# Altium project pdb.PrjPcb
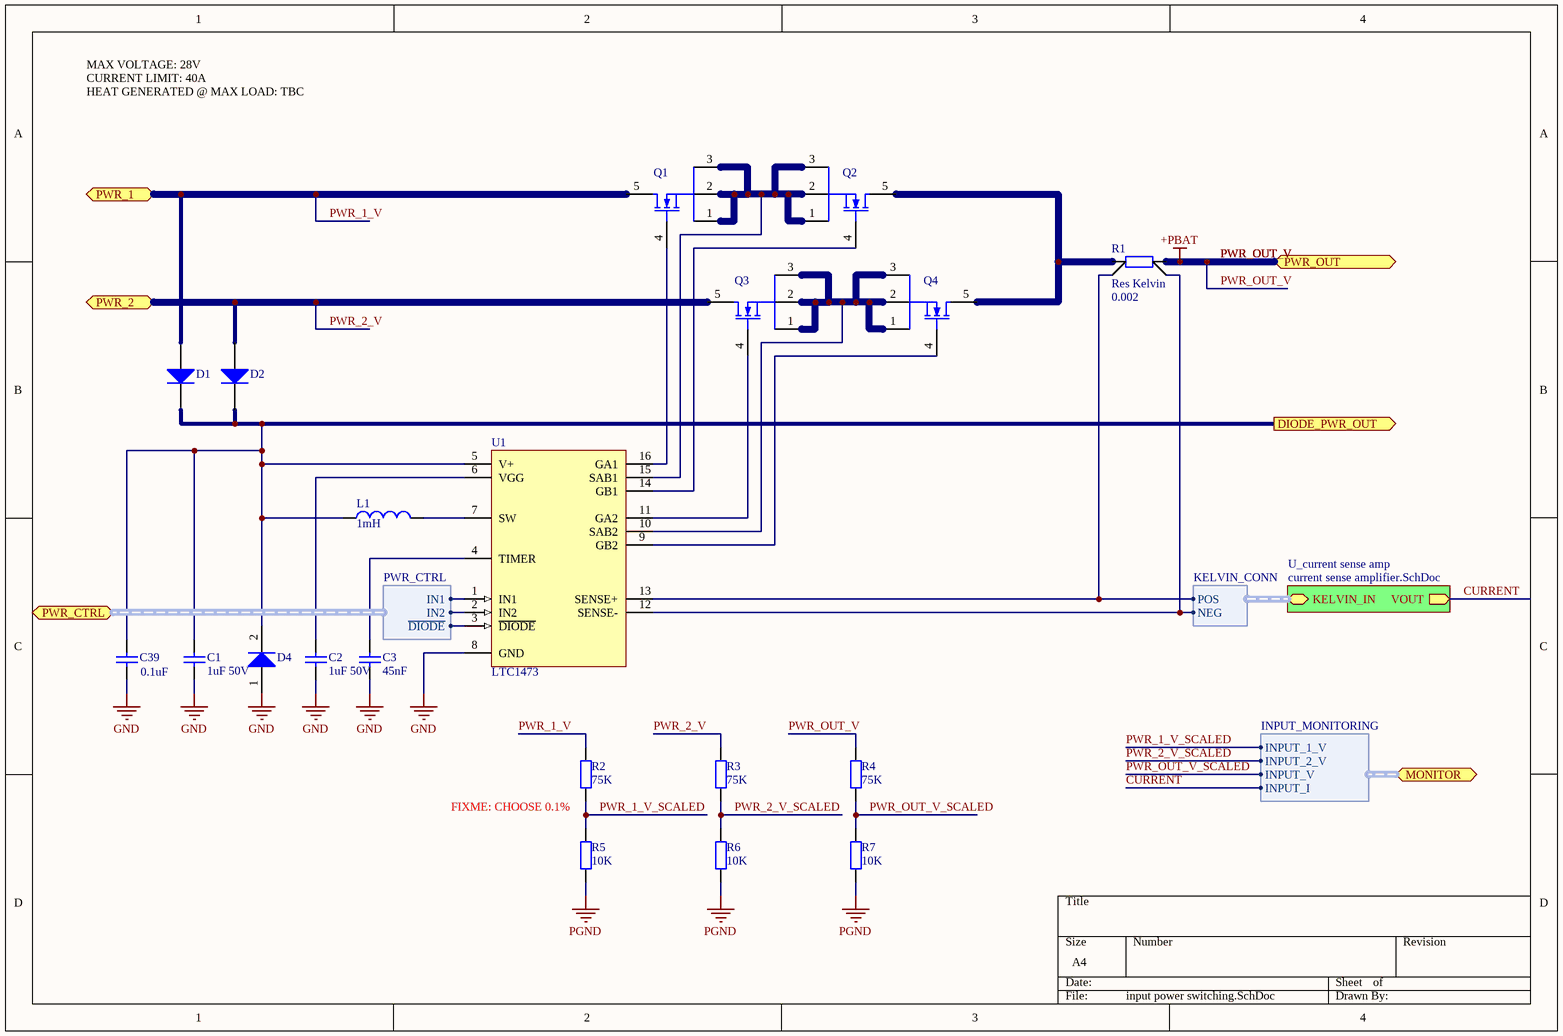
[diagram p0: input power switching.SchDoc]
8 sheets, 51 parts. Net scope: hierarchical (ports join the sheet entries above them; power ports are global).
Board files: pdb.PcbDoc, pdb v2.PcbDoc
Sheets:
  input power switching.SchDoc
  outputs.SchDoc
    U_can connector = can connector.SchDoc
    U_low voltage output controller = low voltage output controller.SchDoc
    U_low voltage output controller = low voltage output controller.SchDoc
  logic.SchDoc
    U_mcu = mcu.SchDoc
    U_spi can controller = spi can controller.SchDoc
    U_Xilinx JTAG Header = Xilinx JTAG Header.SchDoc

## Sheet input power switching.SchDoc
size A4

### Parts
C1  value 1uF 50V  [C0603]  (hidden comment: Cap)
C2  value 1uF 50V  [C0603]  (hidden comment: Cap)
C3  value 45nF  [C0603]  (hidden comment: Cap)
C39  value 0.1uF  [C0603]  (hidden comment: Cap)
D1  Diode  [VS-10BQ030TRPBF]  (value not drawn)
D2  Diode  [VS-10BQ030TRPBF]  (value not drawn)
D4  Diode  [MMBD914LT1G]  (value not drawn)
L1  value 1mH  [744045102]  (hidden comment: Inductor)
Q1  PSMN1R7-30YL  [PSMN1R7-30YL]  (value not drawn)
Q2  PSMN1R7-30YL  [PSMN1R7-30YL]  (value not drawn)
Q3  PSMN1R7-30YL  [PSMN1R7-30YL]  (value not drawn)
Q4  PSMN1R7-30YL  [PSMN1R7-30YL]  (value not drawn)
R1  Res Kelvin  value 0.002  [WSR32L000FEA]  (net tie, no BOM)
R2  value 75K  [R0603]  (hidden comment: Res2)
R3  value 75K  [R0603]  (hidden comment: Res2)
R4  value 75K  [R0603]  (hidden comment: Res2)
R5  value 10K  [R0603]  (hidden comment: Res)
R6  value 10K  [R0603]  (hidden comment: Res)
R7  value 10K  [R0603]  (hidden comment: Res)
U1  LTC1473  [LTC1473]

### Sub-sheets
U_current sense amp = current sense amplifier.SchDoc (file not in this document): KELVIN_IN (harness KELVIN_CONN), VOUT (out)

### Ports
DIODE_PWR_OUT (out), MONITOR (harness INPUT_MONITORING), PWR_1, PWR_2, PWR_CTRL (harness PWR_CTRL), PWR_OUT

### Harnesses
KELVIN_CONN: POS, NEG
PWR_CTRL: IN1, IN2, ~{DIODE}
INPUT_MONITORING: INPUT_I, INPUT_1_V, INPUT_2_V, INPUT_V

### Nets
+PBAT: R4.1 ; port PWR_OUT  [also labelled PWR_OUT_V]
GND: C1.1 C2.1 C3.1 C39.1 D4.1(A) U1.8(GND)
PGND: R5.2 R6.2 R7.2
CURRENT: sheet U_current sense amp/VOUT, port MONITOR.INPUT_I
PWR_1_V: D1.1(A) Q1.5(D) R2.2 ; port PWR_1
PWR_1_V_SCALED: R2.1 R5.1 ; port MONITOR.INPUT_1_V
PWR_2_V: D2.1(A) Q3.5(D) R3.2 ; port PWR_2
PWR_2_V_SCALED: R3.1 R6.1 ; port MONITOR.INPUT_2_V
PWR_OUT_V_SCALED: R4.1 R7.1 ; port MONITOR.INPUT_V
NetC1_2: C1.2 C39.2 D1.2(K) D2.2(K) D4.2(K) L1.1 U1.5(V+) ; port DIODE_PWR_OUT
NetC2_2: C2.2 U1.6(VGG)
NetC3_2: C3.2 U1.4(TIMER)
NetL1_2: L1.2 U1.7(SW)
NetQ1_1: Q1.1(S) Q1.2(S) Q1.3(S) Q2.1(S) Q2.2(S) Q2.3(S) U1.15(SAB1)
NetQ1_4: Q1.4(G) U1.16(GA1)
NetQ2_4: Q2.4(G) U1.14(GB1)
NetQ2_5: Q2.5(D) Q4.5(D) R1.2
NetQ3_1: Q3.1(S) Q3.2(S) Q3.3(S) Q4.1(S) Q4.2(S) Q4.3(S) U1.10(SAB2)
NetQ3_4: Q3.4(G) U1.11(GA2)
NetQ4_4: Q4.4(G) U1.9(GB2)
NetR1_3: R1.3 U1.12(SENSE-) ; sheet U_current sense amp/KELVIN_IN.NEG
NetR1_4: R1.4 U1.13(SENSE+) ; sheet U_current sense amp/KELVIN_IN.POS
NetU1_1: U1.1(IN1) ; port PWR_CTRL.IN1
NetU1_2: U1.2(IN2) ; port PWR_CTRL.IN2
NetU1_3: U1.3(~{DIODE}) ; port PWR_CTRL.~{DIODE}

Not connected (* = marked no-connect by the designer): R1 1

### Notes on the sheet
- MAX VOLTAGE: 28V
- CURRENT LIMIT: 40A
- HEAT GENERATED @ MAX LOAD: TBC
- FIXME: CHOOSE 0.1%

### Library data of the parts
C1-C3 C39 = Cap: Capacitor; Published: 8-Jun-2000; LatestRevisionDate: 17-Jul-2002; LatestRevisionNote: Re-released for DXP Platform.; PackageReference: RAD-0.3; Publisher: Altium Limited
  C1 C2: farnell: 1845736
  C3: farnell: 1759031
  C39: farnell: 9406140
D1 D2 D4 = Diode: Default Diode; Published: 8-Jun-2000; LatestRevisionDate: 17-Jul-2002; LatestRevisionNote: Re-released for DXP Platform.; PackageVersion: Sep-1996; PackageReference: SMC; Publisher: Altium Limited; Code_JEDEC: DO-214-AB
  D1 D2: farnell: 9100687
  D4: farnell: 1431125
L1 = Inductor: Code_IEC: 1005; Published: 8-Jun-2000; LatestRevisionDate: 29-May-2009; LatestRevisionNote: IPC-7351 Footprint Added.; PackageReference: 0402-A; Publisher: Altium Limited; PackageDescription: Chip Inductor; Code_JEITA: 0402; farnell: 1800422
Q1-Q4 = PSMN1R7-30YL: NXP - PSMN1R7-30YL - MOSFET, N CH 30V 100A SOT669; farnell: 1699701
R1 = Res Kelvin: Resistor Kelvin; Published: 8-Jun-2000; LatestRevisionDate: 17-Jul-2002; LatestRevisionNote: Re-released for DXP Platform.; PackageReference: AXIAL-0.4; Publisher: Altium Limited; farnell: 1107461
R2-R7 = Res2: Resistor
  R2-R4: Published: 8-Jun-2000; LatestRevisionDate: 17-Jul-2002; LatestRevisionNote: Re-released for DXP Platform.; PackageReference: AXIAL-0.4; Publisher: Altium Limited; farnell: 9331522
  R5-R7: farnell: 1576297
U1 = LTC1473: IC SWITCH DVR PWRPATH DUAL16SSOP; digikey: LTC1473CGN#PBF-ND; farnell: 1273517

## Sheet outputs.SchDoc
size A4
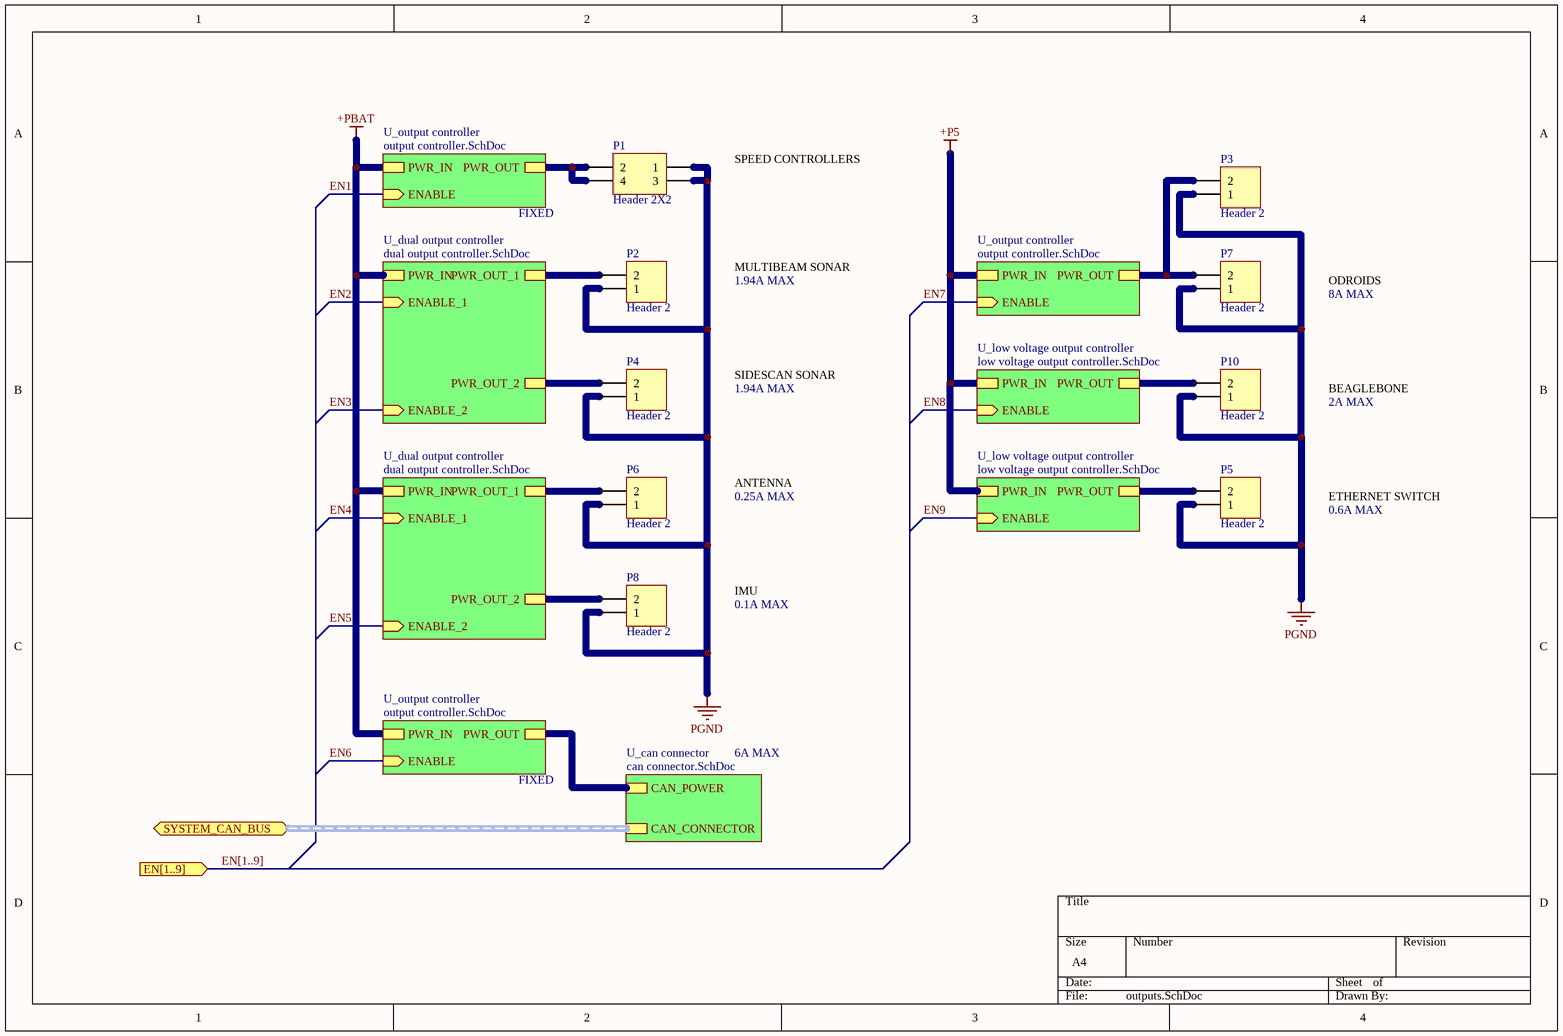
[diagram p1: outputs.SchDoc]

### Parts
(Parts that share a designator on the sheet are numbered #1, #2 ... from top to bottom, then left to right.)
P1#1  Header 2X2  [39-28-1043]
P2  Header 2  [39-28-1023]
P3  Header 2  [43045-0212]
P4  Header 2  [39-28-1023]
P5  Header 2  [43045-0212]
P6  Header 2  [39-28-1023]
P7  Header 2  [43045-0212]
P8  Header 2  [39-28-1023]
P10  Header 2  [43045-0212]

### Sub-sheets
U_can connector = can connector.SchDoc: CAN_CONNECTOR (harness CAN), CAN_POWER
U_dual output controller = dual output controller.SchDoc (file not in this document): ENABLE_1 (in), ENABLE_2 (in), PWR_OUT_1, PWR_OUT_2, PWR_IN
U_dual output controller = dual output controller.SchDoc (file not in this document): ENABLE_1 (in), ENABLE_2 (in), PWR_OUT_1, PWR_OUT_2, PWR_IN
U_low voltage output controller = low voltage output controller.SchDoc: PWR_IN, PWR_OUT, ENABLE (in)
U_low voltage output controller = low voltage output controller.SchDoc: PWR_IN, PWR_OUT, ENABLE (in)
U_output controller = output controller.SchDoc (file not in this document): PWR_IN, PWR_OUT, ENABLE (in)
U_output controller = output controller.SchDoc (file not in this document): PWR_IN, PWR_OUT, ENABLE (in)
U_output controller = output controller.SchDoc (file not in this document): PWR_IN, PWR_OUT, ENABLE (in)

### Ports
EN[1..9] (in), SYSTEM_CAN_BUS (harness CAN)

### Nets
+P5: sheet U_output controller/PWR_IN, sheet U_low voltage output controller/PWR_IN, sheet U_low voltage output controller/PWR_IN
+PBAT: sheet U_output controller/PWR_IN, sheet U_output controller/PWR_IN, sheet U_dual output controller/PWR_IN, sheet U_dual output controller/PWR_IN
PGND: P1#1.1 P1#1.3 P2.1 P3.1 P4.1 P5.1 P6.1 P7.1 P8.1 P10.1
EN1: sheet U_output controller/ENABLE
EN2: sheet U_dual output controller/ENABLE_1
EN3: sheet U_dual output controller/ENABLE_2
EN4: sheet U_dual output controller/ENABLE_1
EN5: sheet U_dual output controller/ENABLE_2
EN6: sheet U_output controller/ENABLE
EN7: sheet U_output controller/ENABLE
NetP1#1_2: P1#1.2 P1#1.4 ; sheet U_output controller/PWR_OUT
NetP2_2: P2.2 ; sheet U_dual output controller/PWR_OUT_1
NetP3_2: P3.2 P7.2 ; sheet U_output controller/PWR_OUT
NetP4_2: P4.2 ; sheet U_dual output controller/PWR_OUT_2
NetP5_2: P5.2 ; sheet U_low voltage output controller/PWR_OUT
NetP6_2: P6.2 ; sheet U_dual output controller/PWR_OUT_1
NetP8_2: P8.2 ; sheet U_dual output controller/PWR_OUT_2
NetP10_2: P10.2 ; sheet U_low voltage output controller/PWR_OUT
NetP11_2: sheet U_can connector/CAN_POWER, sheet U_output controller/PWR_OUT

### Buses and harness runs
bus EN[1..9] = port EN[1..9]
harness port SYSTEM_CAN_BUS = sheet U_can connector/CAN_CONNECTOR

### Notes on the sheet
- SPEED CONTROLLERS
- FIXED
- MULTIBEAM SONAR
- 1.94A MAX
- ODROIDS
- 8A MAX
- SIDESCAN SONAR
- BEAGLEBONE
- 2A MAX
- ANTENNA
- 0.25A MAX
- ETHERNET SWITCH
- 0.6A MAX
- IMU
- 0.1A MAX
- 6A MAX

### Library data of the parts
P1#1 = Header 2X2: Header, 2-Pin, Dual row; LatestRevisionDate: 17-Jul-2002; LatestRevisionNote: Re-released for DXP Platform.; Publisher: Altium Limited; farnell: 9732098
P2-P8 P10 = Header 2: Header, 2-Pin; LatestRevisionDate: 17-Jul-2002; LatestRevisionNote: Re-released for DXP Platform.; Publisher: Altium Limited
  P2 P4 P6 P8: farnell: 9732080
  P3 P5 P7 P10: farnell: 9733000

## Sheet can connector.SchDoc
size A4
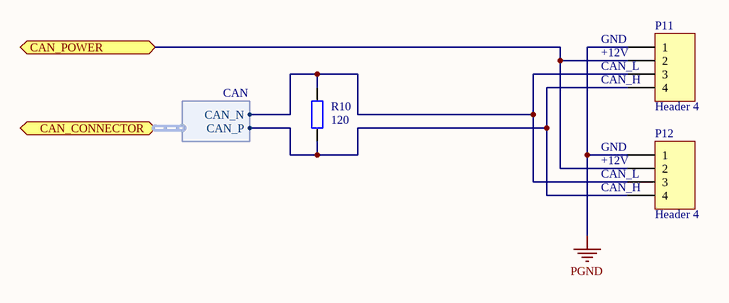
[diagram p2: can connector.SchDoc]

### Parts
P11  Header 4  [B04B-PASK-1]
P12  Header 4  [B04B-PASK-1]
R10  value 120  [R0603]  (hidden comment: Res2)

### Ports
CAN_CONNECTOR (harness CAN), CAN_POWER

### Harnesses
CAN: CAN_N, CAN_P

### Nets
PGND: P11.1 P12.1
NetP11_2: P11.2 P12.2 ; port CAN_POWER
NetP11_3: P11.3 P12.3 R10.2 ; port CAN_CONNECTOR.CAN_N
NetP11_4: P11.4 P12.4 R10.1 ; port CAN_CONNECTOR.CAN_P

### Notes on the sheet
- (near P11) GND
- (near P11) +12V
- (near P11) CAN_L
- (near P11) CAN_H
- (near P12) GND
- (near P12) +12V
- (near P12) CAN_L
- (near P12) CAN_H

### Library data of the parts
P11 P12 = Header 4: Header, 4-Pin; LatestRevisionDate: 17-Jul-2002; LatestRevisionNote: Re-released for DXP Platform.; Publisher: Altium Limited; farnell: 1830749
R10 = Res2: Resistor; Published: 8-Jun-2000; LatestRevisionDate: 17-Jul-2002; LatestRevisionNote: Re-released for DXP Platform.; PackageReference: AXIAL-0.4; Publisher: Altium Limited; farnell: 9330496

## Sheet low voltage output controller.SchDoc
size A4
Used 2 times, as channels U_low voltage output controller, U_low voltage output controller. Parts and nets are listed once, with the designators drawn on the sheet.
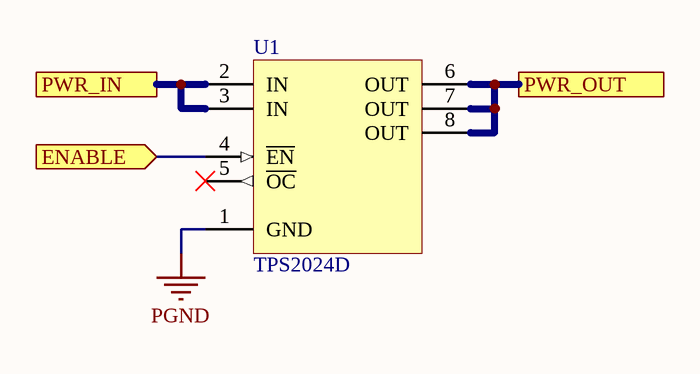
[diagram p3: low voltage output controller.SchDoc]

### Parts
U1  TPS2024D  [TPS2024D]

### Ports
ENABLE (in), PWR_IN, PWR_OUT

### Nets
PGND: U1.1(GND)
ENABLE: U1.4(~{EN}) ; port ENABLE
PWR_IN: U1.2(IN) U1.3(IN) ; port PWR_IN
PWR_OUT: U1.6(OUT) U1.7(OUT) U1.8(OUT) ; port PWR_OUT

Not connected (* = marked no-connect by the designer): U1 5(~{OC})*

### Channels
U_low voltage output controller: designators U1=U2; ports ENABLE=EN8 PWR_IN=+P5 PWR_OUT=NetP10_2
U_low voltage output controller: designators U1=U3; ports ENABLE=EN9 PWR_IN=+P5 PWR_OUT=NetP5_2

### Library data of the parts
U1 = TPS2024D: TEXAS INSTRUMENTS - TPS2024D - IC, 3A PWR DIST SWITCH 8-SOIC; farnell: 1755295

## Sheet logic.SchDoc
size A4
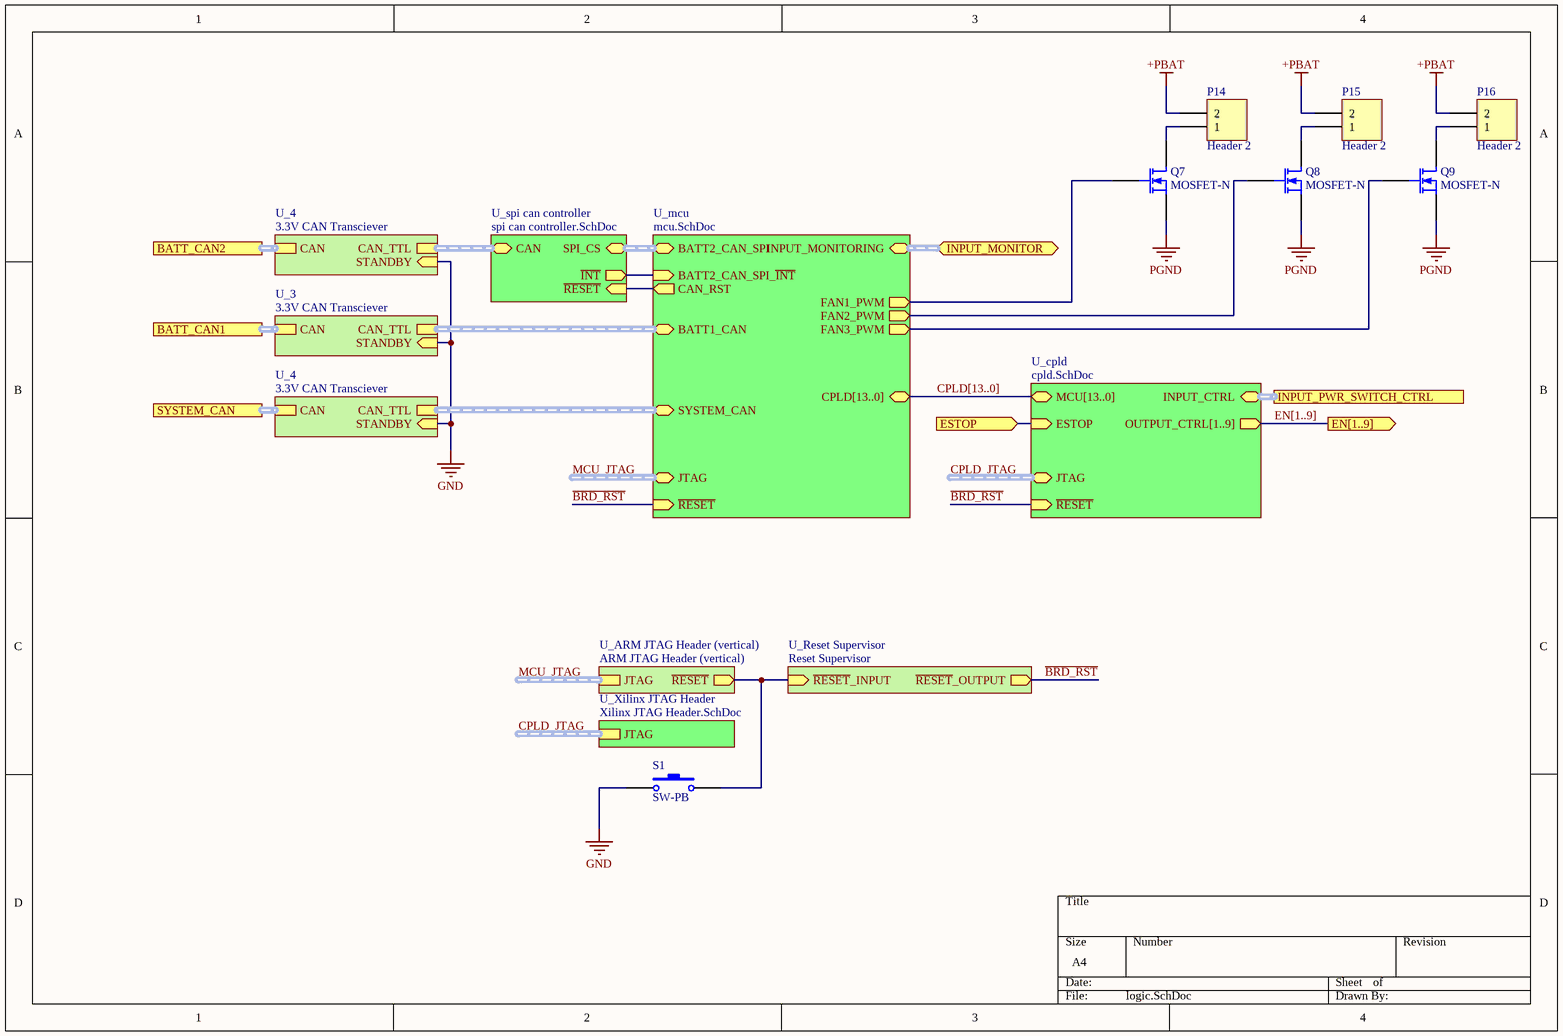
[diagram p4: logic.SchDoc]

### Parts
P14  Header 2  [HDR1X2]
P15  Header 2  [HDR1X2]
P16  Header 2  [HDR1X2]
Q7  MOSFET-N  [TSM2306CX]
Q8  MOSFET-N  [TSM2306CX]
Q9  MOSFET-N  [TSM2306CX]
S1  SW-PB  [DTSM-32S-B]

### Sub-sheets
U_3 = 3.3V CAN Transciever (file not in this document): CAN_TTL (harness CAN_TTL), CAN (harness CAN), STANDBY (in)
U_4 = 3.3V CAN Transciever (file not in this document): CAN_TTL (harness CAN_TTL), CAN (harness CAN), STANDBY (in)
U_4 = 3.3V CAN Transciever (file not in this document): CAN_TTL (harness CAN_TTL), CAN (harness CAN), STANDBY (in)
U_ARM JTAG Header (vertical) = ARM JTAG Header (vertical) (file not in this document): JTAG (harness ARM_JTAG), ~{RESET} (out)
U_cpld = cpld.SchDoc (file not in this document): OUTPUT_CTRL[1..9] (out), INPUT_CTRL (harness PWR_CTRL), ESTOP (in), MCU[13..0] (bidir), JTAG (harness ARM_JTAG), ~{RESET} (in)
U_mcu = mcu.SchDoc: SYSTEM_CAN (harness CAN_TTL), BATT2_CAN_SPI (harness SPI_CS), BATT1_CAN (harness CAN_TTL), CPLD[13..0] (bidir), JTAG (harness ARM_JTAG), ~{RESET} (in), BATT2_CAN_SPI_~{INT} (in), CAN_RST (out), FAN1_PWM (out), FAN2_PWM (out), FAN3_PWM (out), INPUT_MONITORING (harness INPUT_MONITORING)
U_Reset Supervisor = Reset Supervisor (file not in this document): ~{RESET}_OUTPUT (out), ~{RESET}_INPUT (in)
U_spi can controller = spi can controller.SchDoc: CAN (harness CAN_TTL), SPI_CS (harness SPI_CS), ~{INT} (out), ~{RESET} (in)
U_Xilinx JTAG Header = Xilinx JTAG Header.SchDoc: JTAG (harness ARM_JTAG)

### Ports
BATT_CAN1 (harness CAN), BATT_CAN2 (harness CAN), EN[1..9] (out), ESTOP (in), INPUT_MONITOR (harness INPUT_MONITORING), INPUT_PWR_SWITCH_CTRL (harness PWR_CTRL), SYSTEM_CAN (harness CAN)

### Nets
+PBAT: P14.2 P15.2 P16.2
GND: S1.1 ; sheet U_3/STANDBY, sheet U_4/STANDBY, sheet U_4/STANDBY
PGND: Q7.3(S) Q8.3(S) Q9.3(S)
~{BRD_RST}: sheet U_cpld/~{RESET}, sheet U_mcu/~{RESET}, sheet U_Reset Supervisor/~{RESET}_OUTPUT
NetP14_1: P14.1 Q7.1(D)
NetP15_1: P15.1 Q8.1(D)
NetP16_1: P16.1 Q9.1(D)
NetQ7_2: Q7.2(G) ; sheet U_mcu/FAN1_PWM
NetQ8_2: Q8.2(G) ; sheet U_mcu/FAN2_PWM
NetQ9_2: Q9.2(G) ; sheet U_mcu/FAN3_PWM
NetS1_2: S1.2 ; sheet U_Reset Supervisor/~{RESET}_INPUT, sheet U_ARM JTAG Header (vertical)/~{RESET}
NetU4_41: sheet U_mcu/BATT2_CAN_SPI_~{INT}, sheet U_spi can controller/~{INT}
NetU4_44: sheet U_mcu/CAN_RST, sheet U_spi can controller/~{RESET}
(unnamed): port ESTOP, sheet U_cpld/ESTOP

### Buses and harness runs
bus CPLD[13..0] = sheet U_cpld/MCU[13..0] = sheet U_mcu/CPLD[13..0]
bus EN[1..9] = port EN[1..9] = sheet U_cpld/OUTPUT_CTRL[1..9]
harness CPLD_JTAG = sheet U_cpld/JTAG
harness CPLD_JTAG = sheet U_Xilinx JTAG Header/JTAG
harness MCU_JTAG = sheet U_ARM JTAG Header (vertical)/JTAG
harness MCU_JTAG = sheet U_mcu/JTAG
harness port BATT_CAN1 = sheet U_3/CAN
harness port BATT_CAN2 = sheet U_4/CAN
harness port INPUT_MONITOR = sheet U_mcu/INPUT_MONITORING
harness port INPUT_PWR_SWITCH_CTRL = sheet U_cpld/INPUT_CTRL
harness port SYSTEM_CAN = sheet U_4/CAN
harness sheet U_3/CAN_TTL = sheet U_mcu/BATT1_CAN
harness sheet U_4/CAN_TTL = sheet U_mcu/SYSTEM_CAN
harness sheet U_4/CAN_TTL = sheet U_spi can controller/CAN
harness sheet U_mcu/BATT2_CAN_SPI = sheet U_spi can controller/SPI_CS

### Library data of the parts
P14-P16 = Header 2: Header, 2-Pin; LatestRevisionDate: 17-Jul-2002; LatestRevisionNote: Re-released for DXP Platform.; Publisher: Altium Limited
Q7-Q9 = MOSFET-N: N-Channel MOSFET; Published: 8-Jun-2000; LatestRevisionDate: 17-Jul-2002; LatestRevisionNote: Re-released for DXP Platform.; PackageVersion: 1995/1996; PackageReference: E3; Publisher: Altium Limited; farnell: 1864577
S1 = SW-PB: Switch; Published: 24-Mar-1999; LatestRevisionDate: 17-Jul-2002; LatestRevisionNote: Re-released for DXP Platform.; PackageReference: SPST-2; Publisher: Altium Limited; farnell: 9471898

## Sheet mcu.SchDoc
size A4
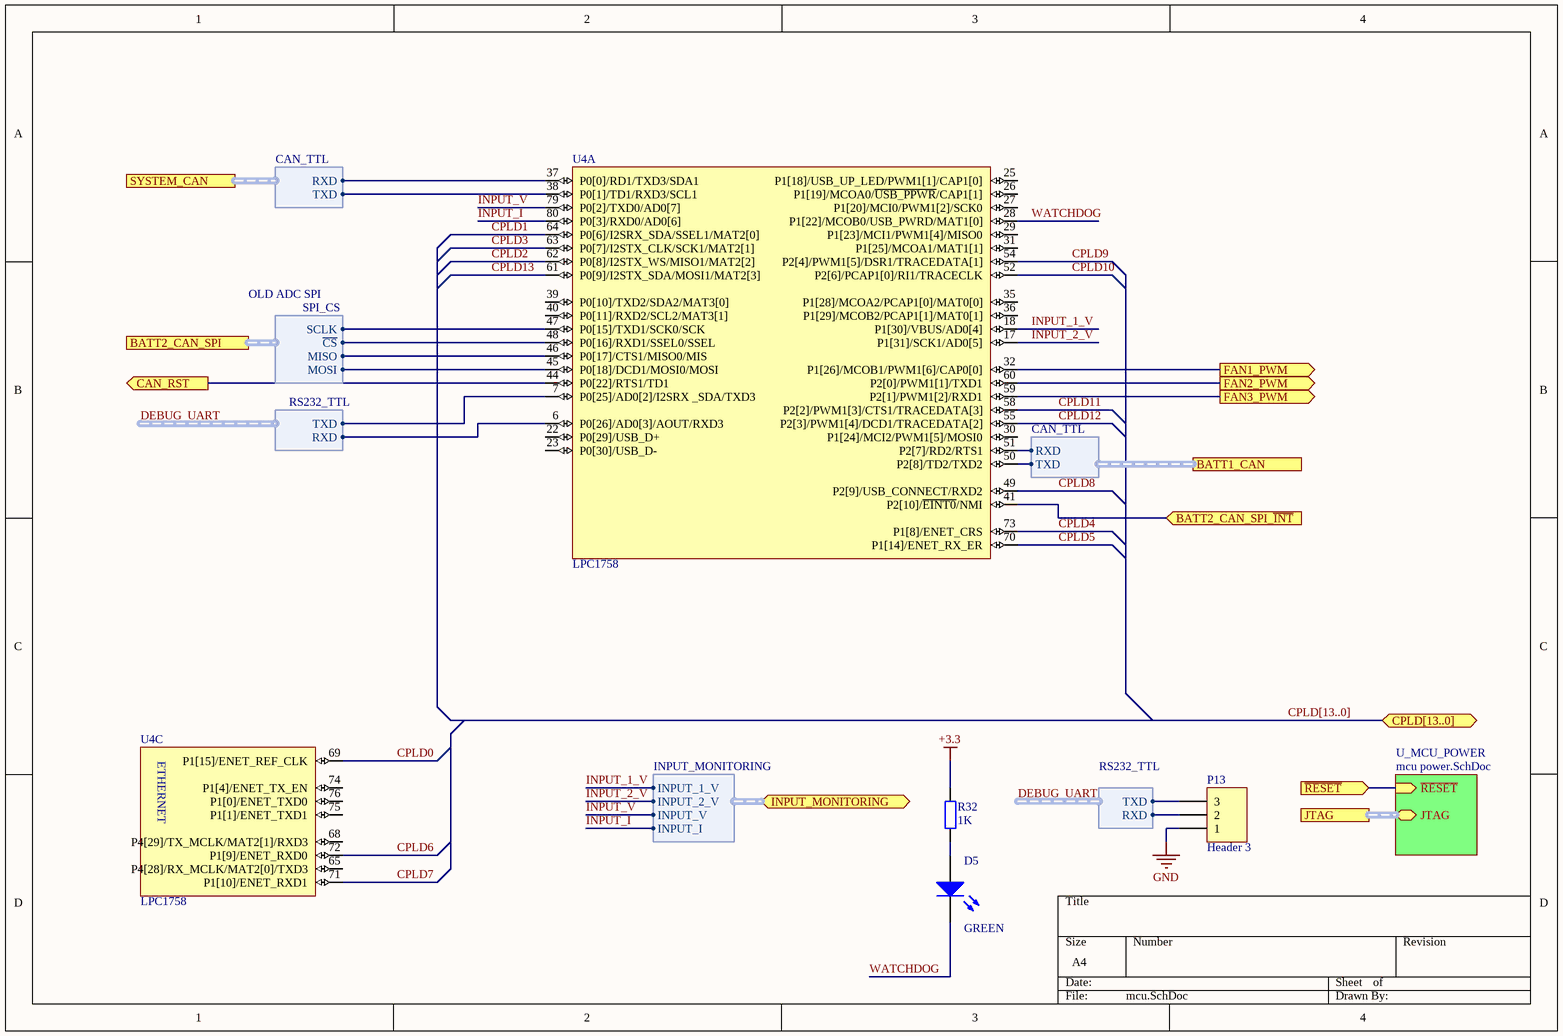
[diagram p5: mcu.SchDoc]

### Parts
D5  value GREEN  [LGQ971]
P13  Header 3  [HDR1X3]
R32  value 1K  [R0603]  (hidden comment: Res)
U4  LPC1758  [LPC1758FBD80]  (parts A,C of 3)

### Sub-sheets
U_MCU_POWER = mcu power.SchDoc (file not in this document): JTAG (harness ARM_JTAG), ~{RESET} (in)

### Ports
BATT1_CAN (harness CAN_TTL), BATT2_CAN_SPI (harness SPI_CS), BATT2_CAN_SPI_~{INT} (in), CAN_RST (out), CPLD[13..0] (bidir), FAN1_PWM (out), FAN2_PWM (out), FAN3_PWM (out), INPUT_MONITORING (harness INPUT_MONITORING), JTAG (harness ARM_JTAG), SYSTEM_CAN (harness CAN_TTL), ~{RESET} (in)

### Harnesses
CAN_TTL: RXD, TXD
SPI_CS: ~{CS}, MISO, MOSI, SCLK
RS232_TTL: RXD, TXD
INPUT_MONITORING: INPUT_1_V, INPUT_2_V, INPUT_I, INPUT_V

### Nets
+3.3: R32.2
GND: P13.1
~{BRD_RST}: port ~{RESET}, sheet U_MCU_POWER/~{RESET}
CPLD0: U4.69(P1[15]/ENET_REF_CLK)
CPLD1: U4.64(P0[6]/I2SRX_SDA/SSEL1/MAT2[0])
CPLD2: U4.62(P0[8]/I2STX_WS/MISO1/MAT2[2])
CPLD3: U4.63(P0[7]/I2STX_CLK/SCK1/MAT2[1])
CPLD4: U4.73(P1[8]/ENET_CRS)
CPLD5: U4.70(P1[14]/ENET_RX_ER)
CPLD6: U4.72(P1[9]/ENET_RXD0)
CPLD7: U4.71(P1[10]/ENET_RXD1)
CPLD8: U4.49(P2[9]/USB_CONNECT/RXD2)
CPLD9: U4.54(P2[4]/PWM1[5]/DSR1/TRACEDATA[1])
CPLD10: U4.52(P2[6]/PCAP1[0]/RI1/TRACECLK)
CPLD11: U4.58(P2[2]/PWM1[3]/CTS1/TRACEDATA[3])
CPLD12: U4.55(P2[3]/PWM1[4]/DCD1/TRACEDATA[2])
CPLD13: U4.61(P0[9]/I2STX_SDA/MOSI1/MAT2[3])
DEBUG_UART.RXD: P13.2 U4.6(P0[26]/AD0[3]/AOUT/RXD3) ; harness RS232_TTL.RXD
DEBUG_UART.TXD: P13.3 U4.7(P0[25]/AD0[2]/I2SRX__SDA/TXD3) ; harness RS232_TTL.TXD
INPUT_1_V: U4.18(P1[30]/VBUS/AD0[4]) ; port INPUT_MONITORING.INPUT_1_V
INPUT_2_V: U4.17(P1[31]/SCK1/AD0[5]) ; port INPUT_MONITORING.INPUT_2_V
INPUT_I: U4.80(P0[3]/RXD0/AD0[6]) ; port INPUT_MONITORING.INPUT_I
INPUT_V: U4.79(P0[2]/TXD0/AD0[7]) ; port INPUT_MONITORING.INPUT_V
WATCHDOG: D5.2(K) U4.28(P1[22]/MCOB0/USB_PWRD/MAT1[0])
NetD5_1: D5.1(A) R32.1
NetQ7_2: U4.32(P1[26]/MCOB1/PWM1[6]/CAP0[0]) ; port FAN1_PWM
NetQ8_2: U4.60(P2[0]/PWM1[1]/TXD1) ; port FAN2_PWM
NetQ9_2: U4.59(P2[1]/PWM1[2]/RXD1) ; port FAN3_PWM
NetU4_37: U4.37(P0[0]/RD1/TXD3/SDA1) ; port SYSTEM_CAN.RXD
NetU4_38: U4.38(P0[1]/TD1/RXD3/SCL1) ; port SYSTEM_CAN.TXD
NetU4_41: U4.41(P2[10]/~{EINT0}/NMI) ; port BATT2_CAN_SPI_~{INT}
NetU4_44: U4.44(P0[22]/RTS1/TD1) ; port CAN_RST
NetU4_45: U4.45(P0[18]/DCD1/MOSI0/MOSI) ; port BATT2_CAN_SPI.MOSI
NetU4_46: U4.46(P0[17]/CTS1/MISO0/MIS) ; port BATT2_CAN_SPI.MISO
NetU4_47: U4.47(P0[15]/TXD1/SCK0/SCK) ; port BATT2_CAN_SPI.SCLK
NetU4_48: U4.48(P0[16]/RXD1/SSEL0/SSEL) ; port BATT2_CAN_SPI.~{CS}
NetU4_50: U4.50(P2[8]/TD2/TXD2) ; port BATT1_CAN.TXD
NetU4_51: U4.51(P2[7]/RD2/RTS1) ; port BATT1_CAN.RXD

Not connected (* = marked no-connect by the designer): U4 22(P0[29]/USB_D+) 23(P0[30]/USB_D-) 25(P1[18]/USB_UP_LED/PWM1[1]/CAP1[0]) 26(P1[19]/MCOA0/~{USB_PPWR}/CAP1[1]) 27(P1[20]/MCI0/PWM1[2]/SCK0) 29(P1[23]/MCI1/PWM1[4]/MISO0) 30(P1[24]/MCI2/PWM1[5]/MOSI0) 31(P1[25]/MCOA1/MAT1[1]) 35(P1[28]/MCOA2/PCAP1[0]/MAT0[0]) 36(P1[29]/MCOB2/PCAP1[1]/MAT0[1]) 39(P0[10]/TXD2/SDA2/MAT3[0]) 40(P0[11]/RXD2/SCL2/MAT3[1]) 65(P4[28]/RX_MCLK/MAT2[0]/TXD3) 68(P4[29]/TX_MCLK/MAT2[1]/RXD3) 74(P1[4]/ENET_TX_EN) 75(P1[1]/ENET_TXD1) 76(P1[0]/ENET_TXD0)

### Buses and harness runs
bus CPLD[13..0] = port CPLD[13..0]
harness port JTAG = sheet U_MCU_POWER/JTAG

### Notes on the sheet
- OLD ADC SPI
- (in symbol LPC1758, part C) ETHERNET

### Library data of the parts
D5 = LED2: Typical RED, GREEN, YELLOW, AMBER GaAs LED; farnell: 1226372
P13 = Header 3: Header, 3-Pin; LatestRevisionDate: 17-Jul-2002; LatestRevisionNote: Re-released for DXP Platform.; Publisher: Altium Limited
R32 = Res2: Resistor; farnell: 9330380
U4 = LPC1758: NXP - LPC1758FBD80 - MCU, 32BIT, ARM CORTEX M3, 80LQFP; farnell: 1718545

## Sheet spi can controller.SchDoc
size A4
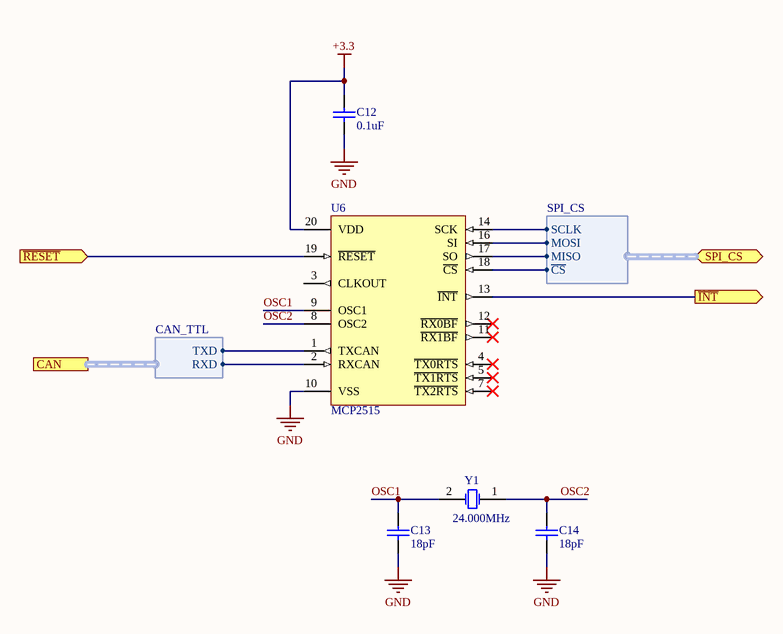
[diagram p6: spi can controller.SchDoc]

### Parts
C12  value 0.1uF  [C0603]  (hidden comment: Cap)
C13  value 18pF  [C0603]  (hidden comment: Cap)
C14  value 18pF  [C0603]  (hidden comment: Cap)
U6  MCP2515  [MCP2515]
Y1  value 24.000MHz  [C3E-24.000-12-3030-X]  (hidden comment: XTAL)

### Ports
CAN (harness CAN_TTL), SPI_CS (harness SPI_CS), ~{INT} (out), ~{RESET} (in)

### Harnesses
SPI_CS: ~{CS}, MISO, MOSI, SCLK
CAN_TTL: RXD, TXD

### Nets
+3.3: C12.1 U6.20(VDD)
GND: C12.2 C13.2 C14.2 U6.10(VSS)
OSC1: C13.1 U6.9(OSC1) Y1.2(OSC2)
OSC2: C14.1 U6.8(OSC2) Y1.1(OSC1)
NetU4_41: U6.13(~{INT}) ; port ~{INT}
NetU4_44: U6.19(~{RESET}) ; port ~{RESET}
NetU4_45: U6.16(SI) ; port SPI_CS.MOSI
NetU4_46: U6.17(SO) ; port SPI_CS.MISO
NetU4_47: U6.14(SCK) ; port SPI_CS.SCLK
NetU4_48: U6.18(~{CS}) ; port SPI_CS.~{CS}
NetU6_1: U6.1(TXCAN) ; port CAN.TXD
NetU6_2: U6.2(RXCAN) ; port CAN.RXD

Not connected (* = marked no-connect by the designer): U6 3(CLKOUT) 4(~{TX0RTS})* 5(~{TX1RTS})* 7(~{TX2RTS})* 11(~{RX1BF})* 12(~{RX0BF})*

### Library data of the parts
C12-C14 = Cap: Capacitor
  C12: farnell: 9406140
  C13 C14: farnell: 1759056
U6 = MCP2515: MICROCHIP - MCP2515-I/ST - CAN CONTROLLER, SMD, 2515, TSSOP20; farnell: 1196851
Y1 = XTAL: Crystal Oscillator; farnell: 1538861

## Sheet Xilinx JTAG Header.SchDoc
size A4
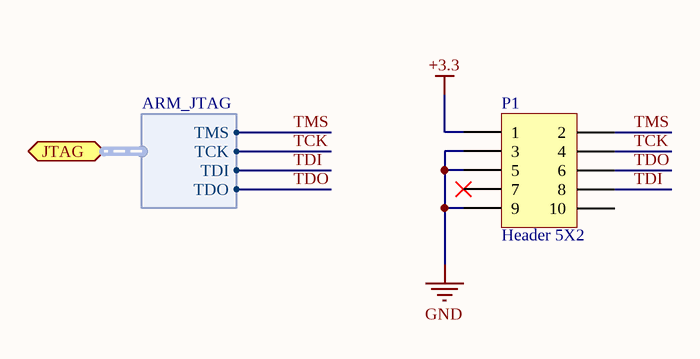
[diagram p7: Xilinx JTAG Header.SchDoc]

### Parts
(Parts that share a designator on the sheet are numbered #1, #2 ... from top to bottom, then left to right.)
P1#2  Header 5X2  [FTSH-105-01-L-DV]

### Ports
JTAG (harness ARM_JTAG)

### Harnesses
ARM_JTAG: TDI, TMS, TCK, TDO

### Nets
+3.3: P1#2.1
GND: P1#2.3 P1#2.5 P1#2.9
TCK: P1#2.4 ; port JTAG.TCK  [project net CPLD_JTAG.TCK]
TDI: P1#2.8 ; port JTAG.TDI  [project net CPLD_JTAG.TDI]
TDO: P1#2.6 ; port JTAG.TDO  [project net CPLD_JTAG.TDO]
TMS: P1#2.2 ; port JTAG.TMS  [project net CPLD_JTAG.TMS]

Not connected (* = marked no-connect by the designer): P1#2 7* 10

### Library data of the parts
P1#2 = Header 5X2: Header, 5-Pin, Dual row; LatestRevisionDate: 17-Jul-2002; LatestRevisionNote: Re-released for DXP Platform.; Publisher: Altium Limited; farnell: 1667759

## Nets that join several sheets
+3.3: mcu (R32.2), spi can controller (C12.1 U6.20), Xilinx JTAG Header (P1#2.1)
+P5: U_low voltage output controller (U2.2 U2.3), U_low voltage output controller (U3.2 U3.3)
+PBAT: input power switching (R4.1), logic (P14.2 P15.2 P16.2)
GND: input power switching (6 pins), logic (S1.1), mcu (P13.1), spi can controller (C12.2 C13.2 C14.2 U6.10), Xilinx JTAG Header (P1#2.3 P1#2.5 P1#2.9)
PGND: input power switching (R5.2 R6.2 R7.2), outputs (10 pins), can connector (P11.1 P12.1), U_low voltage output controller (U2.1), U_low voltage output controller (U3.1), logic (Q7.3 Q8.3 Q9.3)
NetP5_2: outputs (P5.2), U_low voltage output controller (U3.6 U3.7 U3.8)
NetP10_2: outputs (P10.2), U_low voltage output controller (U2.6 U2.7 U2.8)
NetQ7_2: logic (Q7.2), mcu (U4.32)
NetQ8_2: logic (Q8.2), mcu (U4.60)
NetQ9_2: logic (Q9.2), mcu (U4.59)
NetU4_41: mcu (U4.41), spi can controller (U6.13)
NetU4_44: mcu (U4.44), spi can controller (U6.19)
NetU4_45: mcu (U4.45), spi can controller (U6.16)
NetU4_46: mcu (U4.46), spi can controller (U6.17)
NetU4_47: mcu (U4.47), spi can controller (U6.14)
NetU4_48: mcu (U4.48), spi can controller (U6.18)